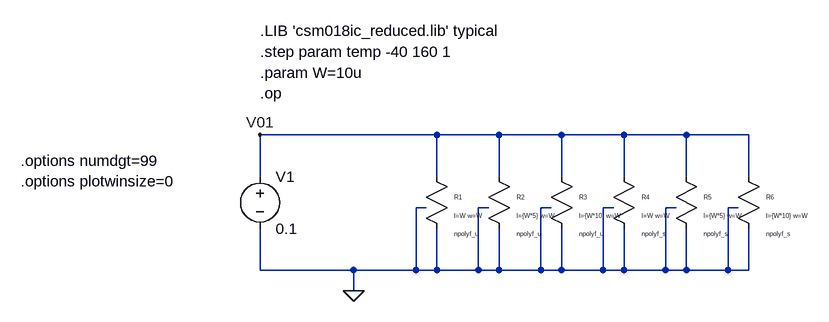
[diagram p0: schematic resistor.asc]
resistor.asc, the LTspice schematic file:
Version 4
SHEET 1 940 680
WIRE 352 112 80 112
WIRE 448 112 352 112
WIRE 544 112 448 112
WIRE 640 112 544 112
WIRE 736 112 640 112
WIRE 832 112 736 112
WIRE 80 176 80 112
WIRE 352 176 352 112
WIRE 448 176 448 112
WIRE 544 176 544 112
WIRE 640 176 640 112
WIRE 736 176 736 112
WIRE 832 176 832 112
WIRE 336 224 320 224
WIRE 432 224 416 224
WIRE 528 224 512 224
WIRE 624 224 608 224
WIRE 720 224 704 224
WIRE 816 224 800 224
WIRE 80 320 80 256
WIRE 224 320 80 320
WIRE 320 320 320 224
WIRE 320 320 224 320
WIRE 352 320 352 256
WIRE 352 320 320 320
WIRE 416 320 416 224
WIRE 416 320 352 320
WIRE 448 320 448 256
WIRE 448 320 416 320
WIRE 512 320 512 224
WIRE 512 320 448 320
WIRE 544 320 544 256
WIRE 544 320 512 320
WIRE 608 320 608 224
WIRE 608 320 544 320
WIRE 640 320 640 256
WIRE 640 320 608 320
WIRE 704 320 704 224
WIRE 704 320 640 320
WIRE 736 320 736 256
WIRE 736 320 704 320
WIRE 800 320 800 224
WIRE 800 320 736 320
WIRE 832 320 832 256
WIRE 832 320 800 320
WIRE 224 352 224 320
FLAG 224 352 0
FLAG 80 112 V01
SYMBOL voltage 80 160 R0
WINDOW 123 0 0 Left 0
WINDOW 39 0 0 Left 0
SYMATTR InstName V1
SYMATTR Value 0.1
SYMBOL res3 336 208 R0
WINDOW 3 43 25 Invisible 0
WINDOW 38 43 56 Left 0
WINDOW 123 43 28 Left 0
SYMATTR Value ""
SYMATTR SpiceModel npolyf_u
SYMATTR Value2 l=W w=W
SYMATTR InstName R1
SYMATTR Prefix X
SYMBOL res3 432 208 R0
WINDOW 3 43 25 Invisible 0
WINDOW 38 43 56 Left 0
WINDOW 123 43 28 Left 0
SYMATTR Value ""
SYMATTR SpiceModel npolyf_u
SYMATTR Value2 l={W*5} w=W
SYMATTR InstName R2
SYMATTR Prefix X
SYMBOL res3 528 208 R0
WINDOW 3 43 25 Invisible 0
WINDOW 38 43 56 Left 0
WINDOW 123 43 28 Left 0
SYMATTR Value ""
SYMATTR SpiceModel npolyf_u
SYMATTR Value2 l={W*10} w=W
SYMATTR InstName R3
SYMATTR Prefix X
SYMBOL res3 624 208 R0
WINDOW 3 43 25 Invisible 0
WINDOW 38 43 56 Left 0
WINDOW 123 43 28 Left 0
SYMATTR Value ""
SYMATTR SpiceModel npolyf_s
SYMATTR Value2 l=W w=W
SYMATTR InstName R4
SYMATTR Prefix X
SYMBOL res3 720 208 R0
WINDOW 3 43 25 Invisible 0
WINDOW 38 43 56 Left 0
WINDOW 123 43 28 Left 0
SYMATTR Value ""
SYMATTR SpiceModel npolyf_s
SYMATTR Value2 l={W*5} w=W
SYMATTR InstName R5
SYMATTR Prefix X
SYMBOL res3 816 208 R0
WINDOW 3 43 25 Invisible 0
WINDOW 38 43 56 Left 0
WINDOW 123 43 28 Left 0
SYMATTR Value ""
SYMATTR SpiceModel npolyf_s
SYMATTR Value2 l={W*10} w=W
SYMATTR InstName R6
SYMATTR Prefix X
TEXT 80 -48 Left 2 !.LIB 'csm018ic_reduced.lib' typical
TEXT 80 48 Left 2 !.op
TEXT -288 152 Left 2 !.options numdgt=99\n.options plotwinsize=0
TEXT 80 -16 Left 2 !.step param temp -40 160 1
TEXT 80 16 Left 2 !.param W=10u

The netlist it stands for:
* resistor.asc
V1 V01 0 0.1
XR1 V01 0 0 npolyf_u l=W w=W  ; pins B A C
XR2 V01 0 0 npolyf_u l={W*5} w=W  ; pins B A C
XR3 V01 0 0 npolyf_u l={W*10} w=W  ; pins B A C
XR4 V01 0 0 npolyf_s l=W w=W  ; pins B A C
XR5 V01 0 0 npolyf_s l={W*5} w=W  ; pins B A C
XR6 V01 0 0 npolyf_s l={W*10} w=W  ; pins B A C
.LIB 'csm018ic_reduced.lib' typical
.op
.options numdgt=99
.options plotwinsize=0
.step param temp -40 160 1
.param W=10u
.backanno
.end